# EAGLE design tssop38 (EAGLE 9.6.2)
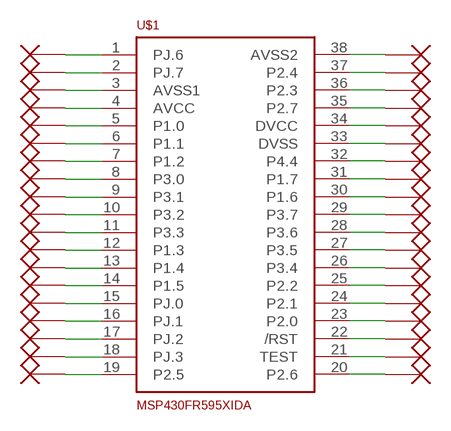
[diagram p0: schematic, sheet 1]

## Parts
P1  PIN  [PIN]
P2  PIN  [PIN]
P3  PIN  [PIN]
P4  PIN  [PIN]
P5  PIN  [PIN]
P6  PIN  [PIN]
P7  PIN  [PIN]
P8  PIN  [PIN]
P9  PIN  [PIN]
P10  PIN  [PIN]
P11  PIN  [PIN]
P12  PIN  [PIN]
P13  PIN  [PIN]
P14  PIN  [PIN]
P15  PIN  [PIN]
P16  PIN  [PIN]
P17  PIN  [PIN]
P18  PIN  [PIN]
P19  PIN  [PIN]
P20  PIN  [PIN]
P21  PIN  [PIN]
P22  PIN  [PIN]
P23  PIN  [PIN]
P24  PIN  [PIN]
P25  PIN  [PIN]
P26  PIN  [PIN]
P27  PIN  [PIN]
P28  PIN  [PIN]
P29  PIN  [PIN]
P30  PIN  [PIN]
P31  PIN  [PIN]
P32  PIN  [PIN]
P33  PIN  [PIN]
P34  PIN  [PIN]
P35  PIN  [PIN]
P36  PIN  [PIN]
P37  PIN  [PIN]
P38  PIN  [PIN]
U$1  MSP430FR595XIDA  [TSSOP38]

## Nets
N$1: P1.P$1 U$1.1(PJ.6)
N$2: P2.P$1 U$1.2(PJ.7)
N$3: P3.P$1 U$1.3(AVSS1)
N$4: P4.P$1 U$1.4(AVCC)
N$5: P5.P$1 U$1.5(P1.0)
N$6: P6.P$1 U$1.6(P1.1)
N$7: P7.P$1 U$1.7(P1.2)
N$8: P8.P$1 U$1.8(P3.0)
N$9: P9.P$1 U$1.9(P3.1)
N$10: P10.P$1 U$1.10(P3.2)
N$11: P11.P$1 U$1.11(P3.3)
N$12: P12.P$1 U$1.12(P1.3)
N$13: P13.P$1 U$1.13(P1.4)
N$14: P14.P$1 U$1.14(P1.5)
N$15: P15.P$1 U$1.15(PJ.0)
N$16: P16.P$1 U$1.16(PJ.1)
N$17: P17.P$1 U$1.17(PJ.2)
N$18: P18.P$1 U$1.18(PJ.3)
N$19: P19.P$1 U$1.19(P2.5)
N$20: P20.P$1 U$1.20(P2.6)
N$21: P21.P$1 U$1.21(TEST)
N$22: P22.P$1 U$1.22(/RST)
N$23: P23.P$1 U$1.23(P2.0)
N$24: P24.P$1 U$1.24(P2.1)
N$25: P25.P$1 U$1.25(P2.2)
N$26: P26.P$1 U$1.26(P3.4)
N$27: P27.P$1 U$1.27(P3.5)
N$28: P28.P$1 U$1.28(P3.6)
N$29: P29.P$1 U$1.29(P3.7)
N$30: P30.P$1 U$1.30(P1.6)
N$31: P31.P$1 U$1.31(P1.7)
N$32: P32.P$1 U$1.32(P4.4)
N$33: P33.P$1 U$1.33(DVSS)
N$34: P34.P$1 U$1.34(DVCC)
N$35: P35.P$1 U$1.35(P2.7)
N$36: P36.P$1 U$1.36(P2.3)
N$37: P37.P$1 U$1.37(P2.4)
N$38: P38.P$1 U$1.38(AVSS2)

## Library data of the parts
P1-P38 = Mechanik:PIN
U$1 = Microcontroller-MSP430:MSP430FR595XIDA

## Board
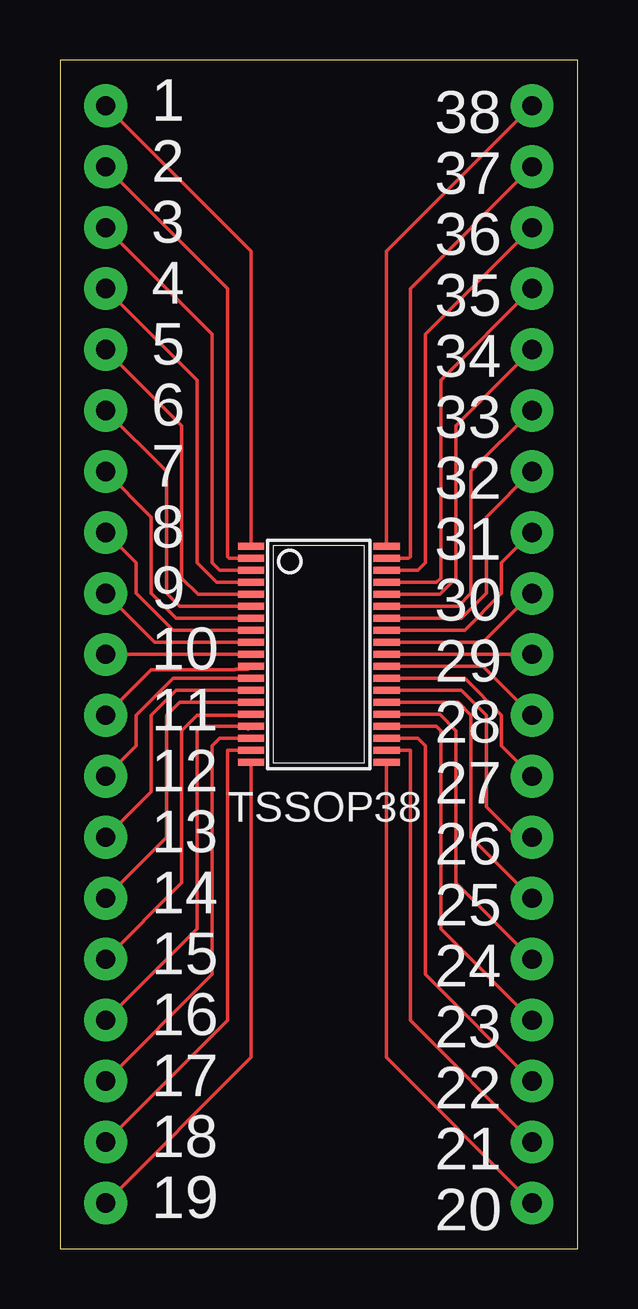
[diagram p1: board, top side]
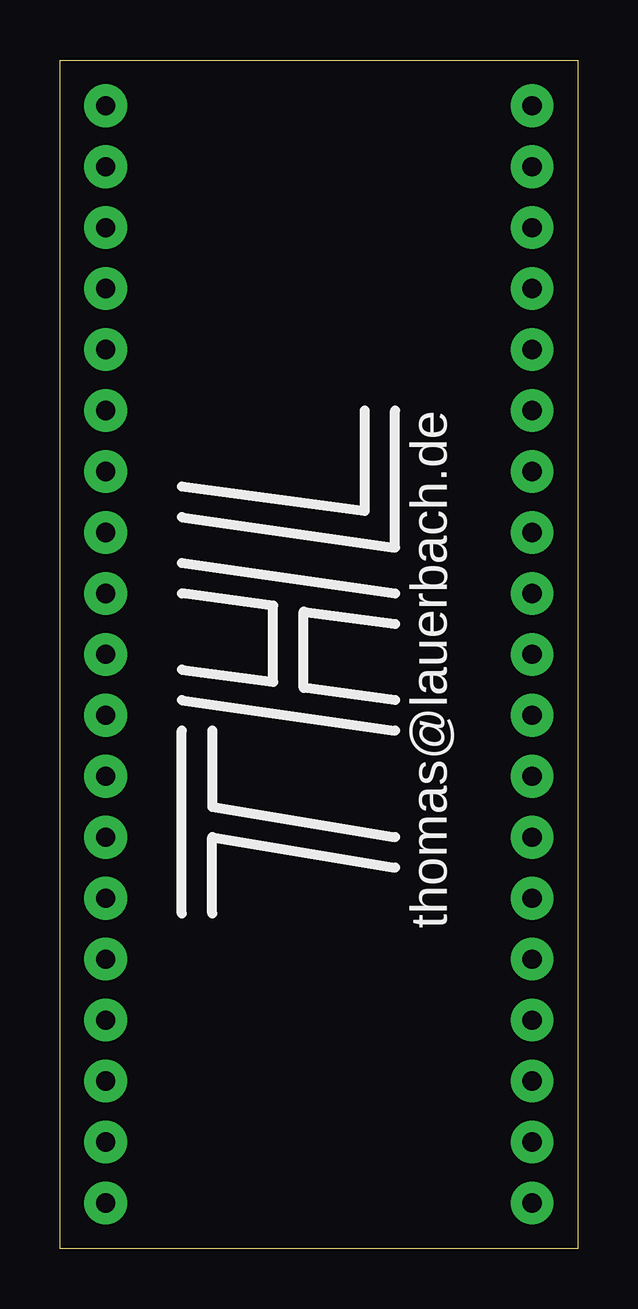
[diagram p2: board, bottom side, seen from below]

Size 21.59 x 49.53 mm. Coordinates in mm from the lower left corner, seen from the top.
Outline: 0,0 21.59,0 21.59,49.53 0,49.52 0,0
Copper layers (1*16): Top 0.035mm / dielectric 1.5mm / Bottom 0.035mm
Design rules "default": minimum track width 6mil, minimum drill 0.35mm, track to track 6mil, track to pad 6mil, pad to pad 6mil, via to via 6mil, smd to smd 6mil, copper to edge 40mil, drill to drill 6mil, minimum pad ring 10mil, minimum via ring 8mil, stop-mask expansion 4mil, vias tented up to drill 0mil, thermal gap 10mil

### Footprints (pad centres in the part's own frame; a part is rotated, then mirrored left to right if it is on the bottom)
PIN = drill 0.8 pad 1.778: P$1 0,0
TSSOP38 = smd 0.3 x 1.1: 1 -4.5,-2.825; 2 -4,-2.825; 3 -3.5,-2.825; 4 -3,-2.825; 5 -2.5,-2.825; 6 -2,-2.825; 7 -1.5,-2.825; 8 -1,-2.825; 9 -0.5,-2.825; 10 0,-2.825; 11 0.5,-2.825; 12 1,-2.825; 13 1.5,-2.825; 14 2,-2.825; 15 2.5,-2.825; 16 3,-2.825; 17 3.5,-2.825; 18 4,-2.825; 19 4.5,-2.825; 20 4.5,2.825; 21 4,2.825; 22 3.5,2.825; 23 3,2.825; 24 2.5,2.825; 25 2,2.825; 26 1.5,2.825; 27 1,2.825; 28 0.5,2.825; 29 0,2.825; 30 -0.5,2.825; 31 -1,2.825; 32 -1.5,2.825; 33 -2,2.825; 34 -2.5,2.825; 35 -3,2.825; 36 -3.5,2.825; 37 -4,2.825; 38 -4.5,2.825

### Placement (x,y rotation side)
P1  1.91,47.62 0 top
P2  1.91,45.09 0 top
P3  1.91,42.55 0 top
P4  1.91,40.01 0 top
P5  1.91,37.47 0 top
P6  1.91,34.92 0 top
P7  1.91,32.38 0 top
P8  1.91,29.84 0 top
P9  1.91,27.3 0 top
P10  1.91,24.77 0 top
P11  1.91,22.23 0 top
P12  1.91,19.68 0 top
P13  1.91,17.14 0 top
P14  1.91,14.61 0 top
P15  1.91,12.06 0 top
P16  1.91,9.53 0 top
P17  1.91,6.99 0 top
P18  1.91,4.45 0 top
P19  1.91,1.91 0 top
P20  19.68,1.91 0 top
P21  19.68,4.45 0 top
P22  19.68,6.99 0 top
P23  19.68,9.53 0 top
P24  19.68,12.06 0 top
P25  19.68,14.61 0 top
P26  19.68,17.14 0 top
P27  19.68,19.68 0 top
P28  19.68,22.23 0 top
P29  19.68,24.77 0 top
P30  19.68,27.3 0 top
P31  19.68,29.84 0 top
P32  19.68,32.38 0 top
P33  19.68,34.92 0 top
P34  19.68,37.47 0 top
P35  19.68,40.01 0 top
P36  19.68,42.55 0 top
P37  19.68,45.09 0 top
P38  19.68,47.62 0 top
U$1  10.79,24.77 270 top
U$2  [THL]  11.43,24.13 90 bottom

### Tracks (layer width: path | path; a pad name or v marks a point on that pad's centre or on a via)
N$1
  Top 0.152: U$1.1 7.97,41.56 P1.P$1
N$2
  Top 0.152: U$1.2 7.05,28.77 6.99,28.83 6.99,40.01 P2.P$1
N$3
  Top 0.152: U$1.3 6.66,28.27 6.35,28.57 6.35,38.1 P3.P$1
N$4
  Top 0.152: U$1.4 6.53,27.77 5.71,28.57 5.71,36.2 P4.P$1
N$5
  Top 0.152: U$1.5 5.75,27.27 5.08,27.94 5.08,34.29 P5.P$1
N$6
  Top 0.152: U$1.6 4.99,26.77 4.45,27.3 4.45,32.38 P6.P$1
N$7
  Top 0.152: U$1.7 4.85,26.27 3.81,27.3 3.81,30.48 P7.P$1
N$8
  Top 0.152: U$1.8 4.71,25.77 3.17,27.3 3.17,28.57 P8.P$1
N$9
  Top 0.152: U$1.9 3.94,25.27 P9.P$1
N$10
  Top 0.152: U$1.10 P10.P$1
N$11
  Top 0.152: U$1.11 7.85,24.14 7.33,24.14 7.31,24.13 3.81,24.13 P11.P$1
N$12
  Top 0.152: U$1.12 4.71,23.77 3.17,22.23 3.17,20.95 P12.P$1
N$13
  Top 0.152: U$1.13 4.85,23.27 3.81,22.23 3.81,19.05 P13.P$1
N$14
  Top 0.152: P14.P$1 4.45,17.14 4.45,22.23 4.99,22.77 U$1.14
N$15
  Top 0.152: U$1.15 7.93,22.23 5.71,22.23 5.08,21.59 5.08,15.24 P15.P$1
N$16
  Top 0.152: 7.85,21.64 U$1.16 5.89,21.77 5.71,21.59 5.71,13.34 P16.P$1
N$17
  Top 0.152: P17.P$1 6.35,11.43 6.35,20.95 6.66,21.27 U$1.17
N$18
  Top 0.152: U$1.18 6.99,20.77 6.99,9.53 P18.P$1
N$19
  Top 0.152: U$1.19 7.97,7.97 P19.P$1
N$20
  Top 0.152: U$1.20 13.62,7.97 P20.P$1
N$21
  Top 0.152: U$1.21 14.61,20.77 14.61,9.53 P21.P$1
N$22
  Top 0.152: U$1.22 14.93,21.27 15.24,20.95 15.24,11.43 P22.P$1
N$23
  Top 0.152: U$1.23 15.7,21.77 15.88,21.59 15.88,13.34 P23.P$1
N$24
  Top 0.152: U$1.24 15.84,22.27 16.51,21.59 16.51,15.24 P24.P$1
N$25
  Top 0.152: U$1.25 16.61,22.77 17.14,22.23 17.14,17.14 P25.P$1
N$26
  Top 0.152: U$1.26 16.74,23.27 17.78,22.23 17.78,18.41 19.05,17.14 P26.P$1
N$27
  Top 0.152: U$1.27 16.88,23.77 18.41,22.23 18.41,20.95 P27.P$1
N$28
  Top 0.152: U$1.28 17.64,24.27 P28.P$1
N$29
  Top 0.152: U$1.29 P29.P$1
N$30
  Top 0.152: U$1.30 17.64,25.27 P30.P$1
N$31
  Top 0.152: U$1.31 16.88,25.77 18.41,27.3 18.41,28.57 P31.P$1
N$32
  Top 0.152: U$1.32 16.74,26.27 17.78,27.3 17.78,30.48 P32.P$1
N$33
  Top 0.152: U$1.33 16.61,26.77 17.14,27.3 17.14,32.38 P33.P$1
N$34
  Top 0.152: U$1.34 15.84,27.27 16.51,27.94 16.51,34.29 P34.P$1
N$35
  Top 0.152: U$1.35 15.7,27.77 15.88,27.94 15.88,36.2 P35.P$1
N$36
  Top 0.152: U$1.36 14.93,28.27 15.24,28.57 15.24,38.1 P36.P$1
N$37
  Top 0.152: U$1.37 14.54,28.77 14.61,28.83 14.61,40.01 P37.P$1
N$38
  Top 0.152: U$1.38 13.62,41.56 P38.P$1

### Text on the board
tNames: 38 | 1 | 37 | 2 | 36 | 3 | 35 | 4 | 34 | 5 | 33 | 6 | 32 | 7 | 31 | 8 | 30 | 9 | 29 | 10 | 28 | 11 | 27 | 12 | TSSOP38 | 26 | 13 | 25 | 14 | 24 | 15 | 23 | 16 | 22 | 17 | 21 | 18 | 20 | 19
bNames: thomas@lauerbach.de